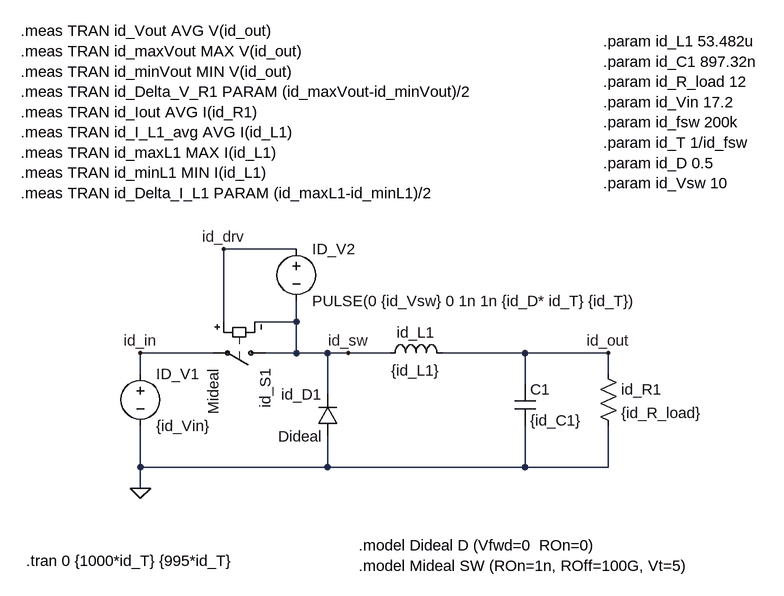
[diagram p0: schematic BoostMichaelGeuze.asc]
BoostMichaelGeuze.asc, the LTspice schematic file:
Version 4
SHEET 1 1092 680
WIRE 352 -32 240 -32
WIRE 240 80 240 -32
WIRE 352 80 352 48
WIRE 352 80 288 80
WIRE 224 128 112 128
WIRE 352 128 352 80
WIRE 352 128 304 128
WIRE 400 128 352 128
WIRE 432 128 400 128
WIRE 496 128 432 128
WIRE 704 128 576 128
WIRE 832 128 704 128
WIRE 112 160 112 128
WIRE 832 160 832 128
WIRE 704 176 704 128
WIRE 400 192 400 128
WIRE 112 304 112 240
WIRE 400 304 400 256
WIRE 400 304 112 304
WIRE 704 304 704 240
WIRE 704 304 400 304
WIRE 832 304 832 240
WIRE 832 304 704 304
WIRE 112 336 112 304
FLAG 112 336 0
FLAG 240 -32 id_drv
FLAG 432 128 id_sw
FLAG 832 128 id_out
FLAG 112 128 id_in
SYMBOL voltage 112 144 R0
SYMATTR InstName ID_V1
SYMATTR Value {id_Vin}
SYMBOL res 816 144 R0
SYMATTR InstName id_R1
SYMATTR Value {id_R_load}
SYMBOL cap 688 176 R0
SYMATTR InstName C1
SYMATTR Value {id_C1}
SYMBOL ind 480 144 R270
WINDOW 0 32 56 VTop 2
WINDOW 3 5 56 VBottom 2
SYMATTR InstName id_L1
SYMATTR Value {id_L1}
SYMBOL diode 416 256 R180
WINDOW 0 24 64 Left 2
WINDOW 3 24 0 Left 2
SYMATTR InstName id_D1
SYMATTR Value Dideal
SYMBOL sw 320 128 R90
SYMATTR InstName id_S1
SYMATTR Value Mideal
SYMBOL voltage 352 -48 R0
WINDOW 123 0 0 Left 0
WINDOW 39 0 0 Left 0
SYMATTR InstName ID_V2
SYMATTR Value PULSE(0 {id_Vsw} 0 1n 1n {id_D* id_T} {id_T})
TEXT 448 424 Left 2 !.model Dideal D (Vfwd=0  ROn=0)\n.model Mideal SW (ROn=1n, ROff=100G, Vt=5)
TEXT 824 -352 Left 2 !.param id_L1 53.482u\n.param id_C1 897.32n \n.param id_R_load 12\n.param id_Vin 17.2\n.param id_fsw 200k\n.param id_T 1/id_fsw\n.param id_D 0.5\n.param id_Vsw 10
TEXT -64 448 Left 2 !.tran 0 {1000*id_T} {995*id_T}
TEXT -72 -368 Left 2 !.meas TRAN id_Vout AVG V(id_out)\n.meas TRAN id_maxVout MAX V(id_out)\n.meas TRAN id_minVout MIN V(id_out)\n.meas TRAN id_Delta_V_R1 PARAM (id_maxVout-id_minVout)/2\n.meas TRAN id_Iout AVG I(id_R1)\n.meas TRAN id_I_L1_avg AVG I(id_L1)\n.meas TRAN id_maxL1 MAX I(id_L1)\n.meas TRAN id_minL1 MIN I(id_L1)\n.meas TRAN id_Delta_I_L1 PARAM (id_maxL1-id_minL1)/2

The netlist it stands for:
* BoostMichaelGeuze.asc
V§ID_V1 id_in 0 {id_Vin}
R§id_R1 id_out 0 {id_R_load}
C1 id_out 0 {id_C1}
L§id_L1 id_sw id_out {id_L1}
D§id_D1 0 id_sw Dideal
S§id_S1 id_sw id_in id_drv id_sw Mideal
V§ID_V2 id_drv id_sw PULSE(0 {id_Vsw} 0 1n 1n {id_D* id_T} {id_T})
.model D D
.lib standard.dio
.model Dideal D (Vfwd=0  ROn=0)
.model Mideal SW (ROn=1n, ROff=100G, Vt=5)
.param id_L1 53.482u
.param id_C1 897.32n
.param id_R_load 12
.param id_Vin 17.2
.param id_fsw 200k
.param id_T 1/id_fsw
.param id_D 0.5
.param id_Vsw 10
.tran 0 {1000*id_T} {995*id_T}
.meas TRAN id_Vout AVG V(id_out)
.meas TRAN id_maxVout MAX V(id_out)
.meas TRAN id_minVout MIN V(id_out)
.meas TRAN id_Delta_V_R1 PARAM (id_maxVout-id_minVout)/2
.meas TRAN id_Iout AVG I(id_R1)
.meas TRAN id_I_L1_avg AVG I(id_L1)
.meas TRAN id_maxL1 MAX I(id_L1)
.meas TRAN id_minL1 MIN I(id_L1)
.meas TRAN id_Delta_I_L1 PARAM (id_maxL1-id_minL1)/2
.backanno
.end

* Results of the author's LTspice run, read from the files saved beside the schematic
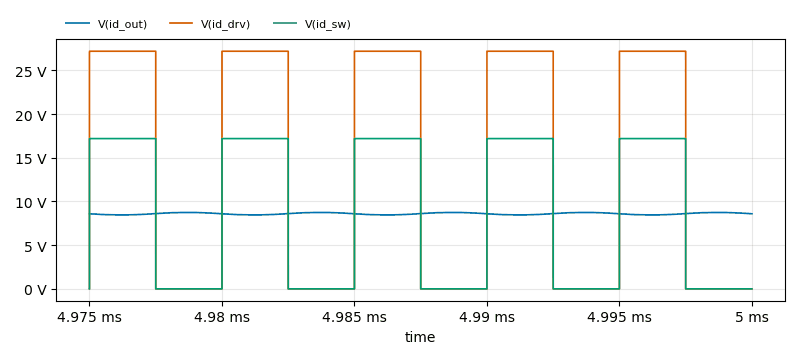
[diagram p1: Transient Analysis of BoostMichaelGeuze.asc, plotted from the saved traces]
* Transient Analysis, 1 run:
*   V(id_out): min 8.461 V, max 8.744 V, average 8.602 V, rms 8.603 V, last 8.591 V
*   V(id_drv): min -920 µV, max 27.2 V, average 13.61 V, rms 19.24 V, last -513.7 µV
*   V(id_sw): min -920.1 µV, max 17.2 V, average 8.603 V, rms 12.16 V, last -513.7 µV